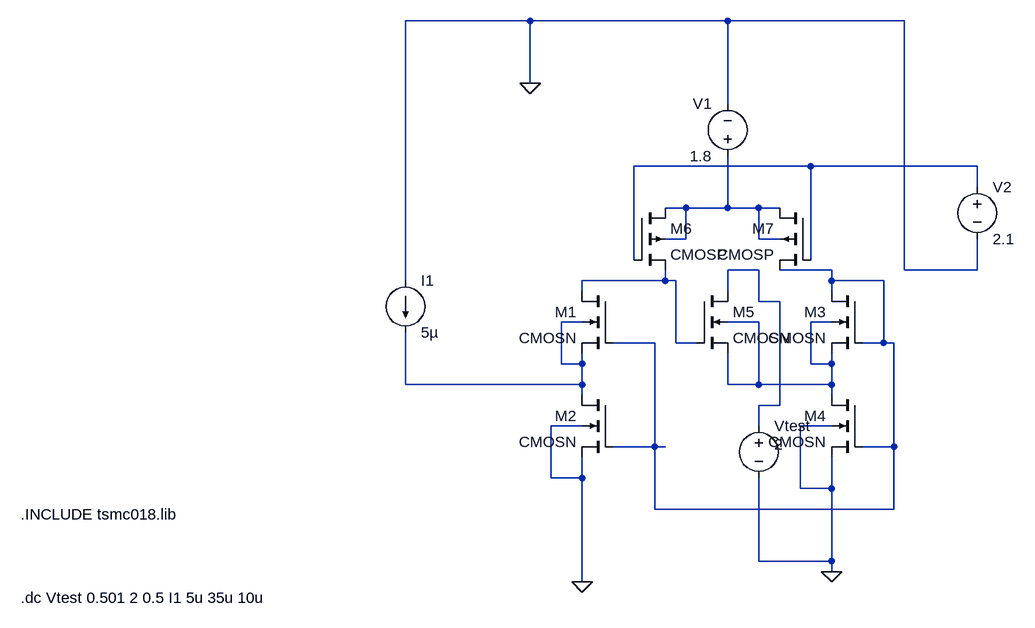
[diagram p0: schematic proposed_mirror.asc]
proposed_mirror.asc, the LTspice schematic file:
Version 4
SHEET 1 880 680
WIRE -864 -720 -1056 -720
WIRE -560 -720 -864 -720
WIRE -288 -720 -560 -720
WIRE -864 -624 -864 -720
WIRE -560 -592 -560 -720
WIRE -432 -496 -704 -496
WIRE -176 -496 -432 -496
WIRE -176 -464 -176 -496
WIRE -624 -432 -656 -432
WIRE -560 -432 -560 -512
WIRE -560 -432 -624 -432
WIRE -512 -432 -560 -432
WIRE -480 -432 -512 -432
WIRE -624 -384 -624 -432
WIRE -624 -384 -656 -384
WIRE -512 -384 -512 -432
WIRE -480 -384 -512 -384
WIRE -704 -352 -704 -496
WIRE -432 -352 -432 -496
WIRE -512 -336 -560 -336
WIRE -400 -336 -480 -336
WIRE -288 -336 -288 -720
WIRE -176 -336 -176 -384
WIRE -176 -336 -288 -336
WIRE -1056 -320 -1056 -720
WIRE -656 -320 -656 -336
WIRE -656 -320 -784 -320
WIRE -640 -320 -656 -320
WIRE -400 -320 -400 -336
WIRE -320 -320 -400 -320
WIRE -784 -304 -784 -320
WIRE -560 -304 -560 -336
WIRE -400 -304 -400 -320
WIRE -512 -288 -512 -336
WIRE -480 -288 -512 -288
WIRE -784 -256 -816 -256
WIRE -512 -256 -560 -256
WIRE -400 -256 -432 -256
WIRE -672 -224 -736 -224
WIRE -640 -224 -640 -320
WIRE -608 -224 -640 -224
WIRE -320 -224 -320 -320
WIRE -320 -224 -352 -224
WIRE -304 -224 -320 -224
WIRE -816 -192 -816 -256
WIRE -784 -192 -784 -208
WIRE -784 -192 -816 -192
WIRE -432 -192 -432 -256
WIRE -400 -192 -400 -208
WIRE -400 -192 -432 -192
WIRE -1056 -160 -1056 -240
WIRE -784 -160 -784 -192
WIRE -784 -160 -1056 -160
WIRE -560 -160 -560 -208
WIRE -512 -160 -512 -256
WIRE -512 -160 -560 -160
WIRE -400 -160 -400 -192
WIRE -400 -160 -512 -160
WIRE -784 -144 -784 -160
WIRE -400 -144 -400 -160
WIRE -480 -128 -480 -288
WIRE -480 -128 -512 -128
WIRE -784 -96 -832 -96
WIRE -512 -96 -512 -128
WIRE -400 -96 -448 -96
WIRE -672 -64 -672 -224
WIRE -672 -64 -736 -64
WIRE -656 -64 -672 -64
WIRE -304 -64 -304 -224
WIRE -304 -64 -352 -64
WIRE -832 -16 -832 -96
WIRE -784 -16 -784 -48
WIRE -784 -16 -832 -16
WIRE -448 0 -448 -96
WIRE -400 0 -400 -48
WIRE -400 0 -448 0
WIRE -672 32 -672 -64
WIRE -304 32 -304 -64
WIRE -304 32 -672 32
WIRE -512 112 -512 -16
WIRE -400 112 -400 0
WIRE -400 112 -512 112
WIRE -400 128 -400 112
WIRE -784 144 -784 -16
FLAG -400 128 0
FLAG -784 144 0
FLAG -864 -624 0
SYMBOL cmosn -736 -304 M0
SYMATTR InstName M1
SYMATTR Value2 l=360nm w=204nm
SYMBOL cmosn -736 -144 M0
SYMATTR InstName M2
SYMATTR Value2 l=360nm w=568nm
SYMBOL cmosn -608 -304 R0
SYMATTR InstName M5
SYMATTR Value2 l=360nm w=364nm
SYMBOL cmosn -352 -304 M0
SYMATTR InstName M3
SYMATTR Value2 l=360nm w=204nm
SYMBOL cmosn -352 -144 M0
SYMATTR InstName M4
SYMATTR Value2 l=360nm w=568nm
SYMBOL cmosp -704 -432 R0
SYMATTR InstName M6
SYMATTR Value2 l=360nm w=403nm
SYMBOL cmosp -432 -432 M0
SYMATTR InstName M7
SYMATTR Value2 l=360nm w=403nm
SYMBOL voltage -560 -496 R180
WINDOW 0 24 96 Left 2
WINDOW 3 24 16 Left 2
WINDOW 123 0 0 Left 0
WINDOW 39 0 0 Left 0
SYMATTR InstName V1
SYMATTR Value 1.8
SYMBOL voltage -512 -112 R0
WINDOW 3 24 44 Left 2
WINDOW 123 24 44 Left 2
WINDOW 39 0 0 Left 0
SYMATTR Value 2
SYMATTR InstName Vtest
SYMBOL voltage -176 -480 R0
WINDOW 123 0 0 Left 0
WINDOW 39 0 0 Left 0
SYMATTR InstName V2
SYMATTR Value 2.1
SYMBOL current -1056 -320 R0
WINDOW 123 0 0 Left 0
WINDOW 39 0 0 Left 0
SYMATTR InstName I1
SYMATTR Value 5µ
TEXT -1648 40 Left 2 !.INCLUDE tsmc018.lib
TEXT -1648 168 Left 2 !.dc Vtest 0.501 2 0.5 I1 5u 35u 10u

The netlist it stands for:
* proposed_mirror.asc
M1 N005 N004 N006 N006 CMOSN l=360nm w=204nm
M2 N006 N004 0 0 CMOSN l=360nm w=568nm
M5 N003 N005 N007 N007 CMOSN l=360nm w=364nm
M3 N004 N004 N007 N007 CMOSN l=360nm w=204nm
M4 N007 N004 0 0 CMOSN l=360nm w=568nm
M6 N002 N001 N005 N002 CMOSP l=360nm w=403nm
M7 N002 N001 N004 N002 CMOSP l=360nm w=403nm
V1 N002 0 1.8
Vtest N003 0 2
V2 N001 0 2.1
I1 0 N006 5µ
.model NMOS NMOS
.model PMOS PMOS
.lib standard.mos
.INCLUDE tsmc018.lib
.dc Vtest 0.501 2 0.5 I1 5u 35u 10u
.backanno
.end